# Altium schematic sheet CurrentSesnse.SchDoc
size A
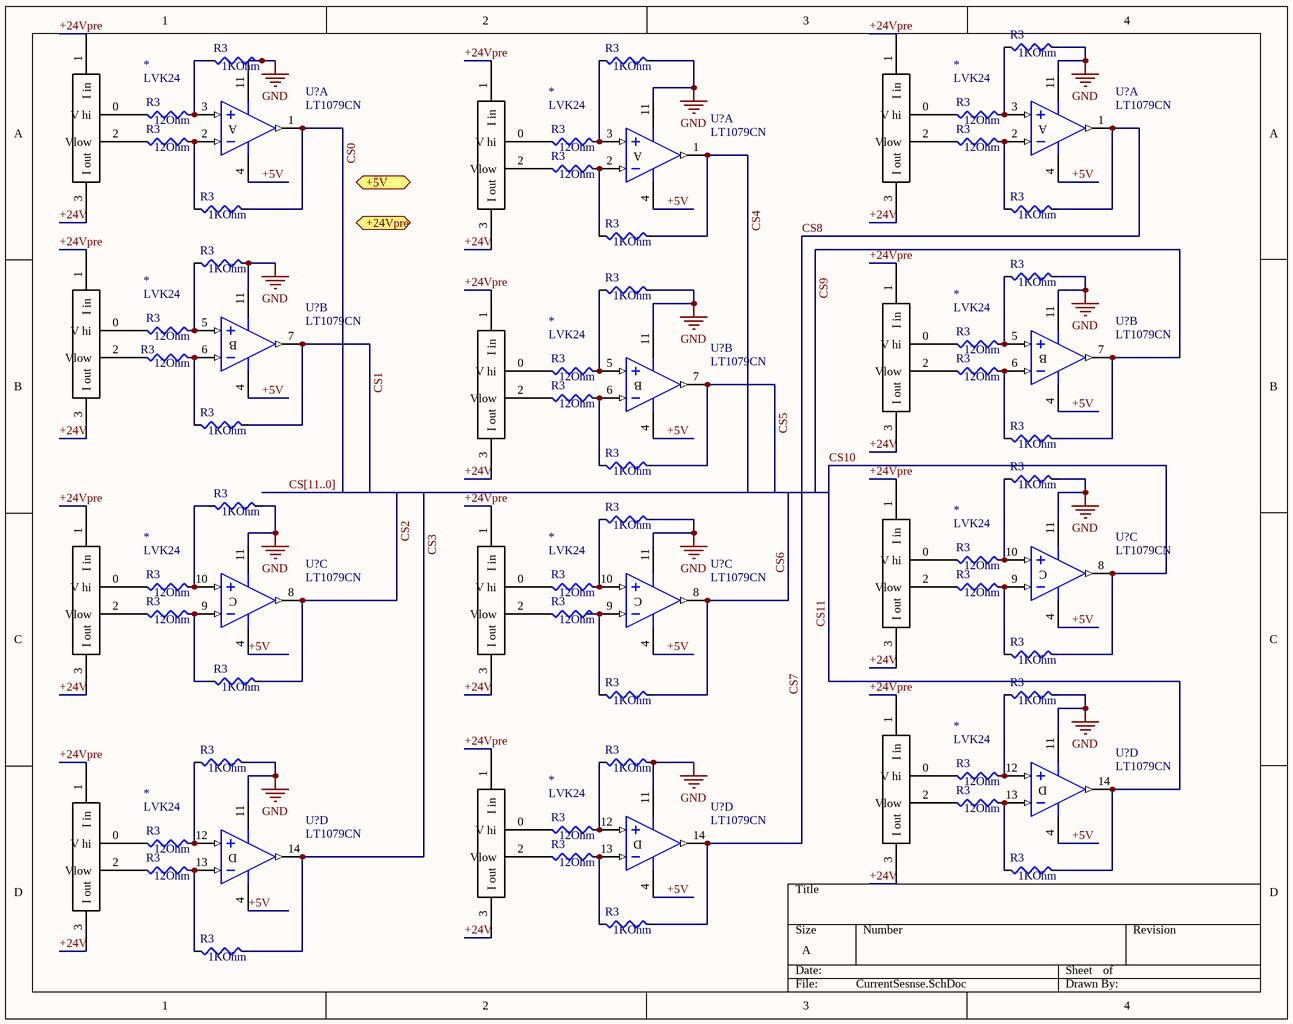
[diagram p0: CurrentSesnse.SchDoc]

## Parts
(Parts that share a designator on the sheet are numbered #1, #2 ... from top to bottom, then left to right.)
*#1  LVK24  [LVK24 Ohmite]
*#2  LVK24  [LVK24 Ohmite]
*#3  LVK24  [LVK24 Ohmite]
*#4  LVK24  [LVK24 Ohmite]
*#5  LVK24  [LVK24 Ohmite]
*#6  LVK24  [LVK24 Ohmite]
*#7  LVK24  [LVK24 Ohmite]
*#8  LVK24  [LVK24 Ohmite]
*#9  LVK24  [LVK24 Ohmite]
*#10  LVK24  [LVK24 Ohmite]
*#11  LVK24  [LVK24 Ohmite]
*#12  LVK24  [LVK24 Ohmite]
R3#1  1KOhm  [R 0805 (2012) RESISTOR]
R3#2  1KOhm  [R 0805 (2012) RESISTOR]
R3#3  1KOhm  [R 0805 (2012) RESISTOR]
R3#4  12Ohm  [R 0805 (2012) RESISTOR]
R3#5  12Ohm  [R 0805 (2012) RESISTOR]
R3#6  12Ohm  [R 0805 (2012) RESISTOR]
R3#7  12Ohm  [R 0805 (2012) RESISTOR]
R3#8  12Ohm  [R 0805 (2012) RESISTOR]
R3#9  12Ohm  [R 0805 (2012) RESISTOR]
R3#10  1KOhm  [R 0805 (2012) RESISTOR]
R3#11  1KOhm  [R 0805 (2012) RESISTOR]
R3#12  1KOhm  [R 0805 (2012) RESISTOR]
R3#13  1KOhm  [R 0805 (2012) RESISTOR]
R3#14  1KOhm  [R 0805 (2012) RESISTOR]
R3#15  1KOhm  [R 0805 (2012) RESISTOR]
R3#16  12Ohm  [R 0805 (2012) RESISTOR]
R3#17  12Ohm  [R 0805 (2012) RESISTOR]
R3#18  12Ohm  [R 0805 (2012) RESISTOR]
R3#19  12Ohm  [R 0805 (2012) RESISTOR]
R3#20  12Ohm  [R 0805 (2012) RESISTOR]
R3#21  12Ohm  [R 0805 (2012) RESISTOR]
R3#22  1KOhm  [R 0805 (2012) RESISTOR]
R3#23  1KOhm  [R 0805 (2012) RESISTOR]
R3#24  1KOhm  [R 0805 (2012) RESISTOR]
R3#25  1KOhm  [R 0805 (2012) RESISTOR]
R3#26  1KOhm  [R 0805 (2012) RESISTOR]
R3#27  1KOhm  [R 0805 (2012) RESISTOR]
R3#28  12Ohm  [R 0805 (2012) RESISTOR]
R3#29  12Ohm  [R 0805 (2012) RESISTOR]
R3#30  12Ohm  [R 0805 (2012) RESISTOR]
R3#31  12Ohm  [R 0805 (2012) RESISTOR]
R3#32  12Ohm  [R 0805 (2012) RESISTOR]
R3#33  12Ohm  [R 0805 (2012) RESISTOR]
R3#34  1KOhm  [R 0805 (2012) RESISTOR]
R3#35  1KOhm  [R 0805 (2012) RESISTOR]
R3#36  1KOhm  [R 0805 (2012) RESISTOR]
R3#37  1KOhm  [R 0805 (2012) RESISTOR]
R3#38  1KOhm  [R 0805 (2012) RESISTOR]
R3#39  1KOhm  [R 0805 (2012) RESISTOR]
R3#40  12Ohm  [R 0805 (2012) RESISTOR]
R3#41  12Ohm  [R 0805 (2012) RESISTOR]
R3#42  12Ohm  [R 0805 (2012) RESISTOR]
R3#43  12Ohm  [R 0805 (2012) RESISTOR]
R3#44  12Ohm  [R 0805 (2012) RESISTOR]
R3#45  12Ohm  [R 0805 (2012) RESISTOR]
R3#46  1KOhm  [R 0805 (2012) RESISTOR]
R3#47  1KOhm  [R 0805 (2012) RESISTOR]
R3#48  1KOhm  [R 0805 (2012) RESISTOR]
U?#1  LT1079CN  [N14]  (part A of 4)
U?#2  LT1079CN  [N14]  (part A of 4)
U?#3  LT1079CN  [N14]  (part A of 4)
U?#4  LT1079CN  [N14]  (part B of 4)
U?#5  LT1079CN  [N14]  (part B of 4)
U?#6  LT1079CN  [N14]  (part B of 4)
U?#7  LT1079CN  [N14]  (part C of 4)
U?#8  LT1079CN  [N14]  (part C of 4)
U?#9  LT1079CN  [N14]  (part C of 4)
U?#10  LT1079CN  [N14]  (part D of 4)
U?#11  LT1079CN  [N14]  (part D of 4)
U?#12  LT1079CN  [N14]  (part D of 4)

## Ports
+5V, +24Vpre

## Nets
GND: R3#1.2 R3#2.2 R3#3.2 R3#13.2 R3#14.2 R3#15.2 R3#25.2 R3#26.2 R3#27.2 R3#37.2 R3#38.2 R3#39.2 U?#1.11(V-) U?#2.11(V-) U?#3.11(V-) U?#4.11(V-) U?#5.11(V-) U?#6.11(V-) U?#7.11(V-) U?#8.11(V-) U?#9.11(V-) U?#10.11(V-) U?#11.11(V-) U?#12.11(V-)
+5V: U?#1.4(V+) U?#2.4(V+) U?#3.4(V+) U?#4.4(V+) U?#5.4(V+) U?#6.4(V+) U?#7.4(V+) U?#8.4(V+) U?#9.4(V+) U?#10.4(V+) U?#11.4(V+) U?#12.4(V+)
+24V: *#1.3(I_out) *#2.3(I_out) *#3.3(I_out) *#4.3(I_out) *#5.3(I_out) *#6.3(I_out) *#7.3(I_out) *#8.3(I_out) *#9.3(I_out) *#10.3(I_out) *#11.3(I_out) *#12.3(I_out)
+24Vpre: *#1.1(I_in) *#2.1(I_in) *#3.1(I_in) *#4.1(I_in) *#5.1(I_in) *#6.1(I_in) *#7.1(I_in) *#8.1(I_in) *#9.1(I_in) *#10.1(I_in) *#11.1(I_in) *#12.1(I_in)
CS0: R3#10.2 U?#1.1(OUT)
CS1: R3#22.2 U?#4.7(OUT)
CS2: R3#35.2 U?#8.8(OUT)
CS3: R3#48.2 U?#12.14(OUT)
CS4: R3#12.2 U?#3.1(OUT)
CS5: R3#24.2 U?#6.7(OUT)
CS6: R3#36.2 U?#9.8(OUT)
CS7: R3#11.2 R3#47.2 U?#2.1(OUT) U?#11.14(OUT)  [also labelled CS8]
CS9: R3#23.2 U?#5.7(OUT)
CS10: R3#34.2 R3#46.2 U?#7.8(OUT) U?#10.14(OUT)  [also labelled CS11]
Net*#1_0: *#1.0(V_hi) R3#4.1
Net*#1_2: *#1.2(Vlow) R3#6.1
Net*#2_0: *#2.0(V_hi) R3#5.1
Net*#2_2: *#2.2(Vlow) R3#8.1
Net*#3_0: *#3.0(V_hi) R3#7.1
Net*#3_2: *#3.2(Vlow) R3#9.1
Net*#4_0: *#4.0(V_hi) R3#16.1
Net*#4_2: *#4.2(Vlow) R3#18.1
Net*#5_0: *#5.0(V_hi) R3#17.1
Net*#5_2: *#5.2(Vlow) R3#20.1
Net*#6_0: *#6.0(V_hi) R3#19.1
Net*#6_2: *#6.2(Vlow) R3#21.1
Net*#7_0: *#7.0(V_hi) R3#28.1
Net*#7_2: *#7.2(Vlow) R3#31.1
Net*#8_0: *#8.0(V_hi) R3#29.1
Net*#8_2: *#8.2(Vlow) R3#32.1
Net*#9_0: *#9.0(V_hi) R3#30.1
Net*#9_2: *#9.2(Vlow) R3#33.1
Net*#10_0: *#10.0(V_hi) R3#40.1
Net*#10_2: *#10.2(Vlow) R3#41.1
Net*#11_0: *#11.0(V_hi) R3#42.1
Net*#11_2: *#11.2(Vlow) R3#44.1
Net*#12_0: *#12.0(V_hi) R3#43.1
Net*#12_2: *#12.2(Vlow) R3#45.1
NetR3#1_1: R3#1.1 R3#5.2 U?#2.3(IN+)
NetR3#2_1: R3#2.1 R3#4.2 U?#1.3(IN+)
NetR3#3_1: R3#3.1 R3#7.2 U?#3.3(IN+)
NetR3#6_2: R3#6.2 R3#10.1 U?#1.2(IN-)
NetR3#8_2: R3#8.2 R3#11.1 U?#2.2(IN-)
NetR3#9_2: R3#9.2 R3#12.1 U?#3.2(IN-)
NetR3#13_1: R3#13.1 R3#16.2 U?#4.5(IN+)
NetR3#14_1: R3#14.1 R3#17.2 U?#5.5(IN+)
NetR3#15_1: R3#15.1 R3#19.2 U?#6.5(IN+)
NetR3#18_2: R3#18.2 R3#22.1 U?#4.6(IN-)
NetR3#20_2: R3#20.2 R3#23.1 U?#5.6(IN-)
NetR3#21_2: R3#21.2 R3#24.1 U?#6.6(IN-)
NetR3#25_1: R3#25.1 R3#28.2 U?#7.10(IN+)
NetR3#26_1: R3#26.1 R3#29.2 U?#8.10(IN+)
NetR3#27_1: R3#27.1 R3#30.2 U?#9.10(IN+)
NetR3#31_2: R3#31.2 R3#34.1 U?#7.9(IN-)
NetR3#32_2: R3#32.2 R3#35.1 U?#8.9(IN-)
NetR3#33_2: R3#33.2 R3#36.1 U?#9.9(IN-)
NetR3#37_1: R3#37.1 R3#40.2 U?#10.12(IN+)
NetR3#38_1: R3#38.1 R3#43.2 U?#12.12(IN+)
NetR3#39_1: R3#39.1 R3#42.2 U?#11.12(IN+)
NetR3#41_2: R3#41.2 R3#46.1 U?#10.13(IN-)
NetR3#44_2: R3#44.2 R3#47.1 U?#11.13(IN-)
NetR3#45_2: R3#45.2 R3#48.1 U?#12.13(IN-)

## Buses and harness runs
bus CS[11..0]

## Notes on the sheet
- (in symbol LT1079CN, part A) A
- (in symbol LT1079CN, part B) B
- (in symbol LT1079CN, part C) C
- (in symbol LT1079CN, part D) D

## Library data of the parts
R3#1-R3#48 = Resistor: Value: 0Ohm
U?#1-U?#12 = LT1079CN: Micropower, Quad, Single Supply, Precision Operational Amplifier; Note: 423; Published: 8-Jun-2000; LatestRevisionDate: 29-May-2009; LatestRevisionNote: Component Body Added.; DatasheetVersion: 1996; PackageVersion: N14 1103; PackageReference: N14; Publisher: Altium Limited; PackageDescription: DIP, Plastic, 14-Pin, Row Spacing 7.62 mm, Pitch 2.54 mm; ComponentLink1Description: Manufacturer Link; ComponentLink1URL: http://www.linear.com/; ComponentLink2Description: Datasheet; ComponentLink2URL: http://www.linear.com/pc/downloadDocument.do?navId=H0,C1,C1154,C1009,C1099,P1277,D1716